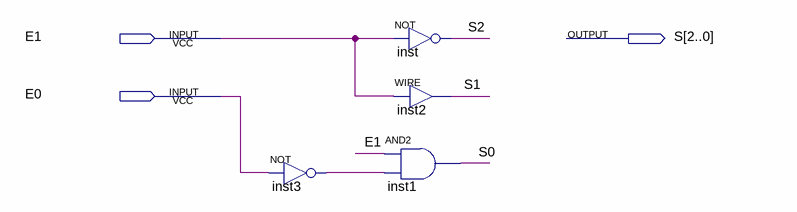
[diagram p0: schematic sheet]
// Quartus schematic abk_moore.bdf as structural Verilog: 4 symbols, 3 pins
module abk_moore (
  input  E1,
  input  E0,
  output [2:0] S
);

  wire inst3_out;

  not inst3 (inst3_out, E0);
  not inst (S[2], E1);
  assign S[1] = E1;  // WIRE inst2
  and inst1 (S[0], E1, inst3_out);
endmodule
